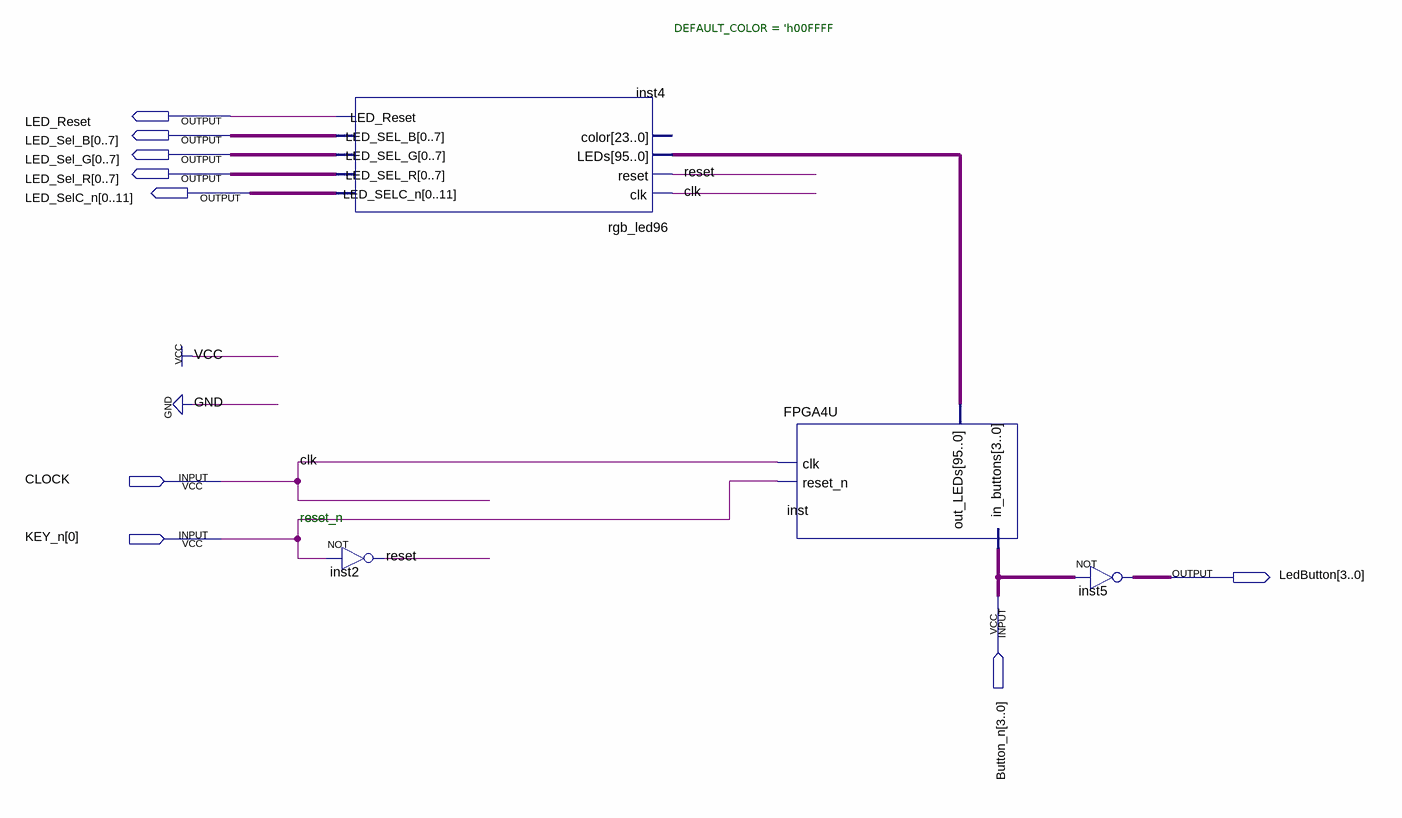
[diagram p0: schematic sheet]
// Quartus schematic FPGA4U_DE0.bdf as structural Verilog: 4 symbols, 9 pins
module FPGA4U_DE0 (
  input  CLOCK,
  input  [0:0] KEY_n,
  input  [3:0] Button_n,
  output LED_Reset,
  output [0:7] LED_Sel_B,
  output [0:7] LED_Sel_G,
  output [0:7] LED_Sel_R,
  output [0:11] LED_SelC_n,
  output [3:0] LedButton
);

  wire reset;
  wire [95:0] inst_out_leds;

  rgb_led96 #(.DEFAULT_COLOR('h00FFFF)) inst4 (
    .clk(CLOCK), .reset(reset), .LEDs(inst_out_leds), .LED_SELC_n(LED_SelC_n), .LED_SEL_R(LED_Sel_R),
    .LED_SEL_G(LED_Sel_G), .LED_SEL_B(LED_Sel_B), .LED_Reset(LED_Reset));  // open: color
  not inst2 (reset, KEY_n[0]);
  FPGA4U inst (.in_buttons(Button_n), .clk(CLOCK), .reset_n(KEY_n[0]), .out_LEDs(inst_out_leds));
  assign LedButton = ~Button_n;  // NOT inst5, 4 bits wide

  // Other names for the same wires on the sheet: clk = CLOCK; reset_n = KEY_n[0]

  // Notes on the sheet:
  //   reset_n
endmodule
